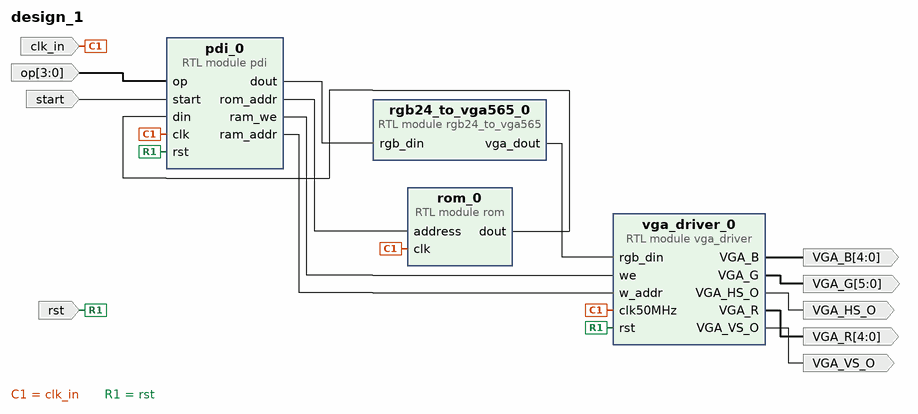
[diagram p0: block diagram of the top level]
# Vivado block design design_1, xc7z010clg400-1, Vivado 2020.1
create_bd_design design_1

create_bd_port -dir I clk_in
create_bd_port -dir I -type rst rst
create_bd_port -dir O VGA_HS_O
create_bd_port -dir O VGA_VS_O
create_bd_port -dir O -from 4 -to 0 VGA_R
create_bd_port -dir O -from 4 -to 0 VGA_B
create_bd_port -dir O -from 5 -to 0 VGA_G
create_bd_port -dir I -from 3 -to 0 op
create_bd_port -dir I start

create_bd_cell -type module -reference rgb24_to_vga565 rgb24_to_vga565_0
create_bd_cell -type module -reference rom rom_0
create_bd_cell -type module -reference vga_driver vga_driver_0
create_bd_cell -type module -reference pdi pdi_0

# ---- connections ----

connect_bd_net -net clk50MHz_1 [get_bd_ports clk_in] [get_bd_pins rom_0/clk] [get_bd_pins vga_driver_0/clk50MHz] [get_bd_pins pdi_0/clk]
connect_bd_net [get_bd_ports rst] [get_bd_pins vga_driver_0/rst] [get_bd_pins pdi_0/rst]
connect_bd_net [get_bd_pins vga_driver_0/VGA_HS_O] [get_bd_ports VGA_HS_O]
connect_bd_net [get_bd_pins vga_driver_0/VGA_VS_O] [get_bd_ports VGA_VS_O]
connect_bd_net [get_bd_pins vga_driver_0/VGA_R] [get_bd_ports VGA_R]
connect_bd_net [get_bd_pins vga_driver_0/VGA_B] [get_bd_ports VGA_B]
connect_bd_net [get_bd_pins vga_driver_0/VGA_G] [get_bd_ports VGA_G]
connect_bd_net [get_bd_pins rgb24_to_vga565_0/vga_dout] [get_bd_pins vga_driver_0/rgb_din]
connect_bd_net [get_bd_pins pdi_0/ram_we] [get_bd_pins vga_driver_0/we]
connect_bd_net [get_bd_pins pdi_0/dout] [get_bd_pins rgb24_to_vga565_0/rgb_din]
connect_bd_net [get_bd_pins rom_0/dout] [get_bd_pins pdi_0/din]
connect_bd_net [get_bd_pins pdi_0/rom_addr] [get_bd_pins rom_0/address]
connect_bd_net [get_bd_pins pdi_0/ram_addr] [get_bd_pins vga_driver_0/w_addr]
connect_bd_net [get_bd_ports op] [get_bd_pins pdi_0/op]
connect_bd_net [get_bd_ports start] [get_bd_pins pdi_0/start]

validate_bd_design
save_bd_design
